# Altium schematic sheet environmental_sensor.SchDoc
size 297 x 209 mm; DrawnBy: Supun; Engineer: Supun; Organization: C3
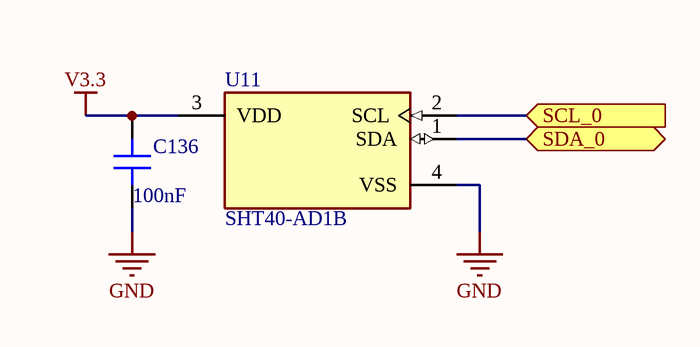
[diagram p0: environmental_sensor.SchDoc]

## Parts
C136  100nF  [CAP 0603_1608]
U11  SHT40-AD1B  [Sensirion_3_MFG]

## Ports
SCL_0 (in), SDA_0 (bidir)

## Nets
GND: C136.2 U11.4(VSS)
V3.3: C136.1 U11.3(VDD)
SCL_0: U11.2(SCL) ; port SCL_0
SDA_0: U11.1(SDA) ; port SDA_0

## Notes on the sheet
- Title
- Size:
- Date:
- A4
- Number:
- Time:
- Revision:
- Sheet
- of
- File:

## Library data of the parts
C136 = Capacitor: SMT Capacitor; MF: TDK; MP: CGA3E2X7R1E104K080AA; Value: 100nF; Link: https://www.mouser.com/ProductDetail/TDK/CGA3E2X7R1E104K080AA?qs=NRhsANhppD%2Fm7%2FOmmsm0vg%3D%3D
U11 = SHT40-AD1B: Board Mount Humidity Sensors Humidity and Temperature Sensor; MF: Sensirion; MP: SHT40-AD1B-R3; Value: *; Link: https://www.mouser.com/ProductDetail/Sensirion/SHT40-AD1B-R3?qs=zW32dvEIR3sa7U6cFW6pBw%3D%3D